# Altium schematic sheet pHCircuit.SchDoc
size A
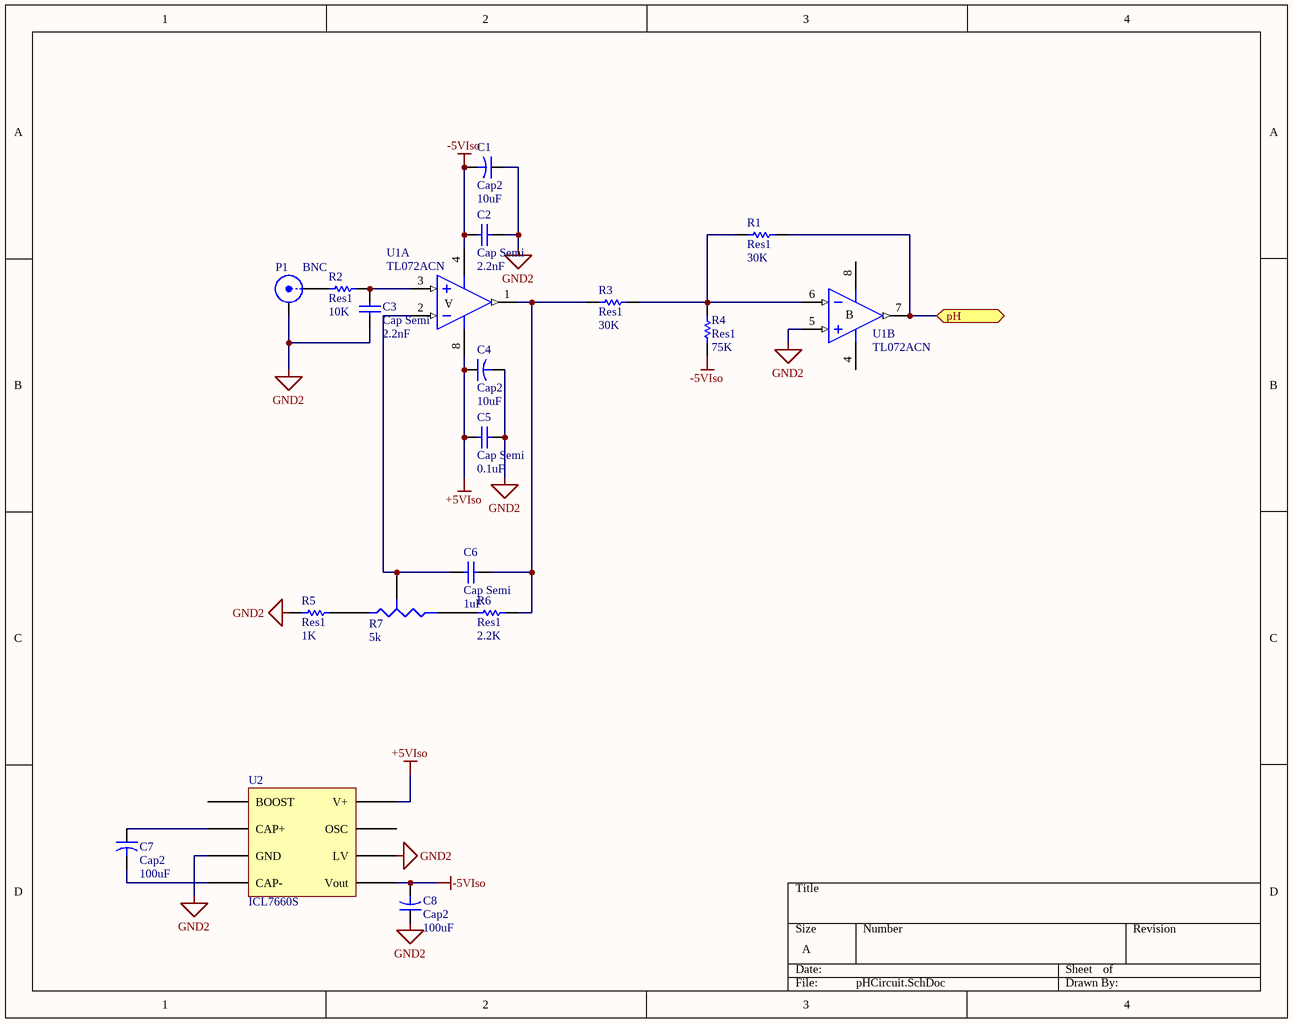
[diagram p0: pHCircuit.SchDoc]

## Parts
C1  Cap2  value 10uF  [CAPC3216L]
C2  Cap Semi  value 2.2nF  [RESC2012L]
C3  Cap Semi  value 2.2nF  [RESC2012L]
C4  Cap2  value 10uF  [CAPC3216L]
C5  Cap Semi  value 0.1uF  [RESC2012L]
C6  Cap Semi  value 1uF  [RESC2012L]
C7  Cap2  value 100uF  [CAPC3216L]
C8  Cap2  value 100uF  [CAPC3216L]
P1  BNC  [BNC_RA CON]
R1  Res1  value 30K  [RESC2012L]
R2  Res1  value 10K  [RESC2012L]
R3  Res1  value 30K  [RESC2012L]
R4  Res1  value 75K  [RESC2012L]
R5  Res1  value 1K  [RESC2012L]
R6  Res1  value 2.2K  [RESC2012L]
R7  5k  [R25_turn_Top]
U1  TL072ACN  [DIP8]  (parts A,B of 2)
U2  ICL7660S  [DIP8]

## Ports
pH

## Nets
+5VIso: C4.1 C5.2 U1.8(V+) U2.8(V+)
-5VIso: C1.2 C2.2 C8.2 R4.1 U1.4(V-) U2.5(Vout)
GND2: C1.1 C2.1 C3.1 C4.2 C5.1 C8.1 P1.2(Y) R5.2 U1.5(IN+) U2.3(GND) U2.6(LV)
pH: R1.1 U1.7(OUT) ; port pH
NetC3_2: C3.2 R2.1 U1.3(IN+)
NetC6_1: C6.1 R3.2 R6.1 U1.1(OUT)
NetC6_2: C6.2 R7.3(TAP) U1.2(IN-)
NetC7_1: C7.1 U2.2(CAP+)
NetC7_2: C7.2 U2.4(CAP-)
NetP1_1: P1.1(X) R2.2
NetR1_2: R1.2 R3.1 R4.2 U1.6(IN-)
NetR5_1: R5.1 R7.1(A)
NetR6_2: R6.2 R7.2(B)

Not connected (* = marked no-connect by the designer): U2 1(BOOST) 7(OSC)

## Notes on the sheet
- (in symbol TL072ACN, part A) A
- (in symbol TL072ACN, part B) B

## Library data of the parts
C1 C4 C7 C8 = Cap2: Capacitor; Published: 23-Sep-2002; PackageReference: CAPR5-4X5; Publisher: Altium Limited
C2 C3 C5 C6 = Cap Semi: Capacitor (Semiconductor SIM Model); Published: 8-Jun-2000; LatestRevisionDate: 29-May-2009; LatestRevisionNote: IPC-7351 Footprint Added.; PackageReference: C1206; Publisher: Altium Limited; PackageDescription: Chip Capacitor
P1 = BNC: BNC Elbow Connector; LatestRevisionDate: 17-Jul-2002; LatestRevisionNote: Re-released for DXP Platform.; Publisher: Altium Limited
R1-R6 = Res1: Resistor; Published: 8-Jun-2000; LatestRevisionDate: 17-Jul-2002; LatestRevisionNote: Re-released for DXP Platform.; PackageReference: AXIAL-0.3; Publisher: Altium Limited
R7 = R25_turn
U1 = TL072ACN: Low-Noise J-FET Dual Operational Amplifier; Published: 24-Aug-2001; LatestRevisionDate: 06-Jun-2005; LatestRevisionNote: Stylized 3D Model Added.; DatasheetVersion: Dec-1998; PackageReference: DIP8; Publisher: Altium Limited; PackageDescription: DIP; 8 Leads; Row Spacing 7.62 mm; Pitch 2.54 mm; Code_JEDEC: MO-001-AN; ComponentLink1Description: Manufacturer Link; ComponentLink1URL: http://www.st.com/; ComponentLink2Description: Datasheet; ComponentLink2URL: http://www.st.com/stonline/products/literature/ds/2298/tl072.pdf